# Altium schematic sheet Roll to Roll Transfer Printer System Schematic.SchDoc
size D; PageSetup: Record=PageOptions|CenterHorizontal=True|CenterVertical=True|PrintScale=0.32|XCorrection=1.00|YCorrection=1.00|PrintKind=1|BorderSize=5000000|LeftOffset=0|BottomOffset=0|Orientation=2|PaperLength=1000|PaperWidth=1000|Scale=100|PaperSource=7|PrintQuality=-4|MediaType=1|DitherType=10|PaperKind=Letter (8.5" x 11")|PrintScaleMode=1
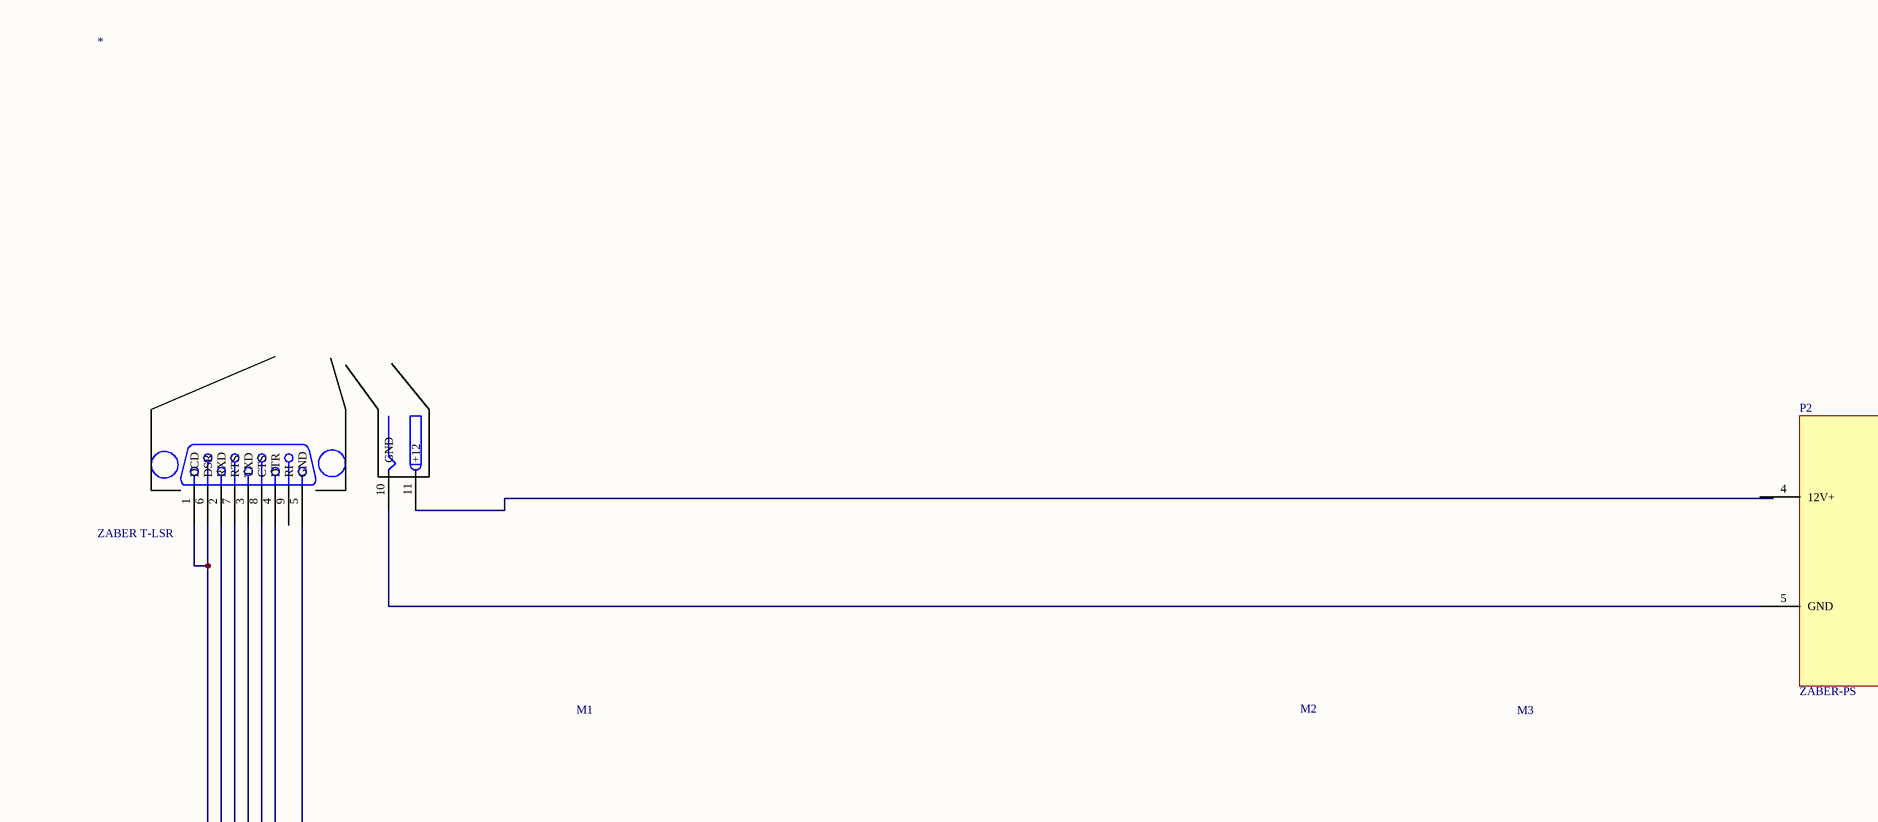
[diagram p0: Roll to Roll Transfer Printer System Schematic.SchDoc, top left]
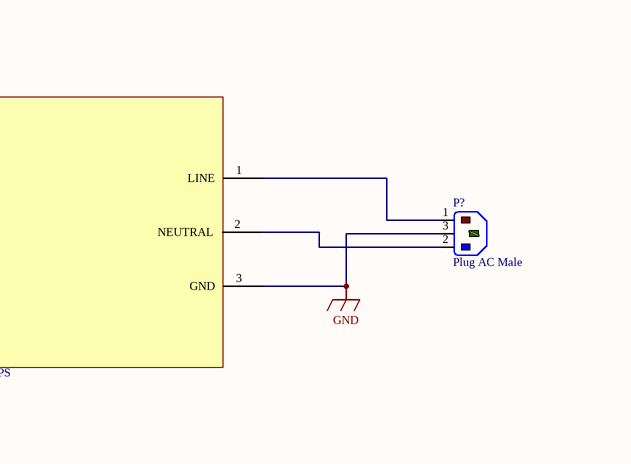
[diagram p1: Roll to Roll Transfer Printer System Schematic.SchDoc, top right]
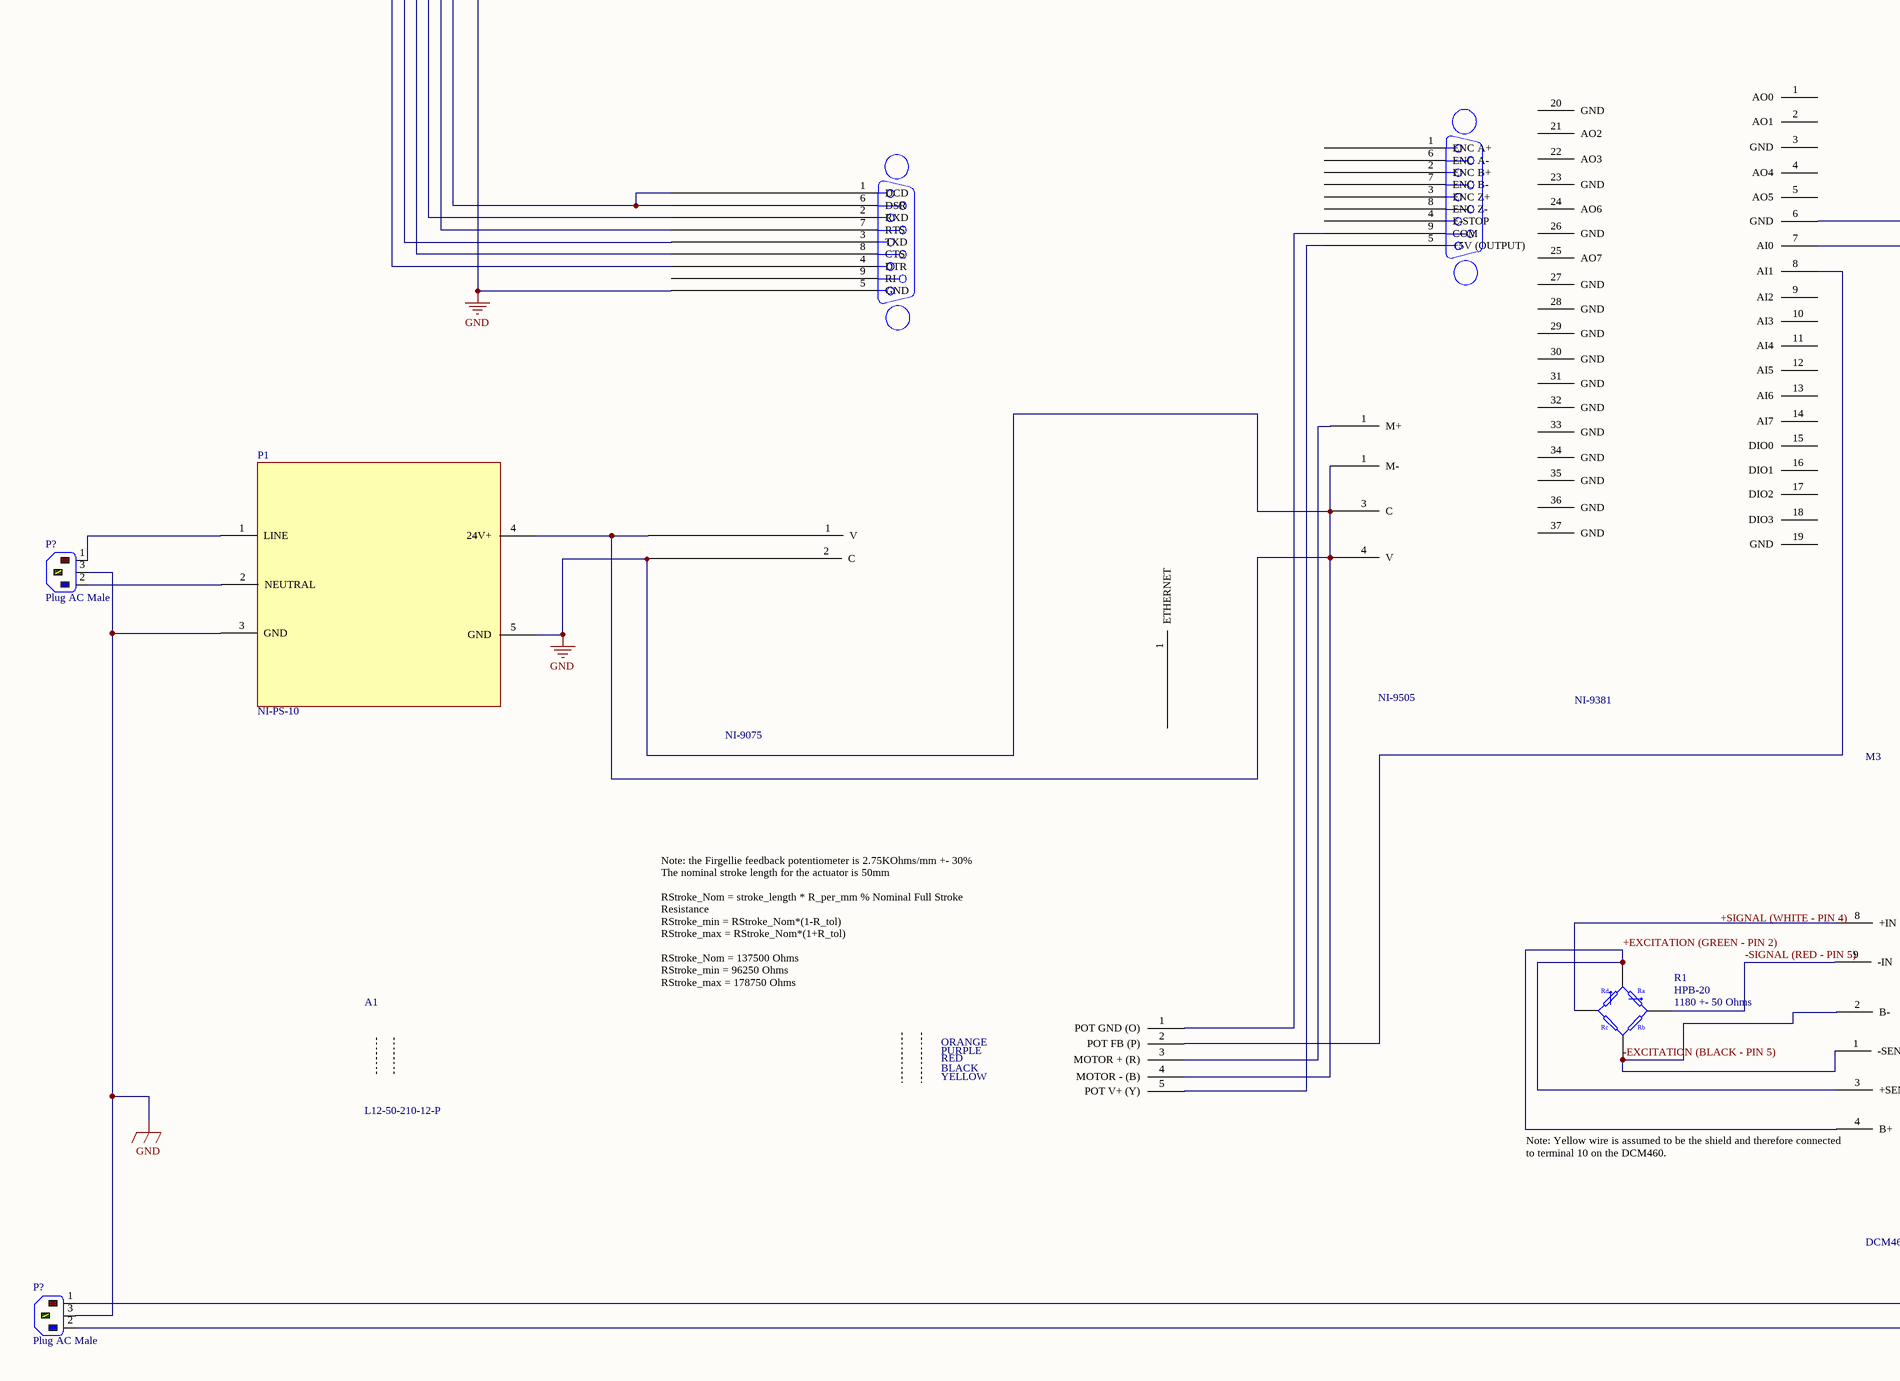
[diagram p2: Roll to Roll Transfer Printer System Schematic.SchDoc, bottom left]
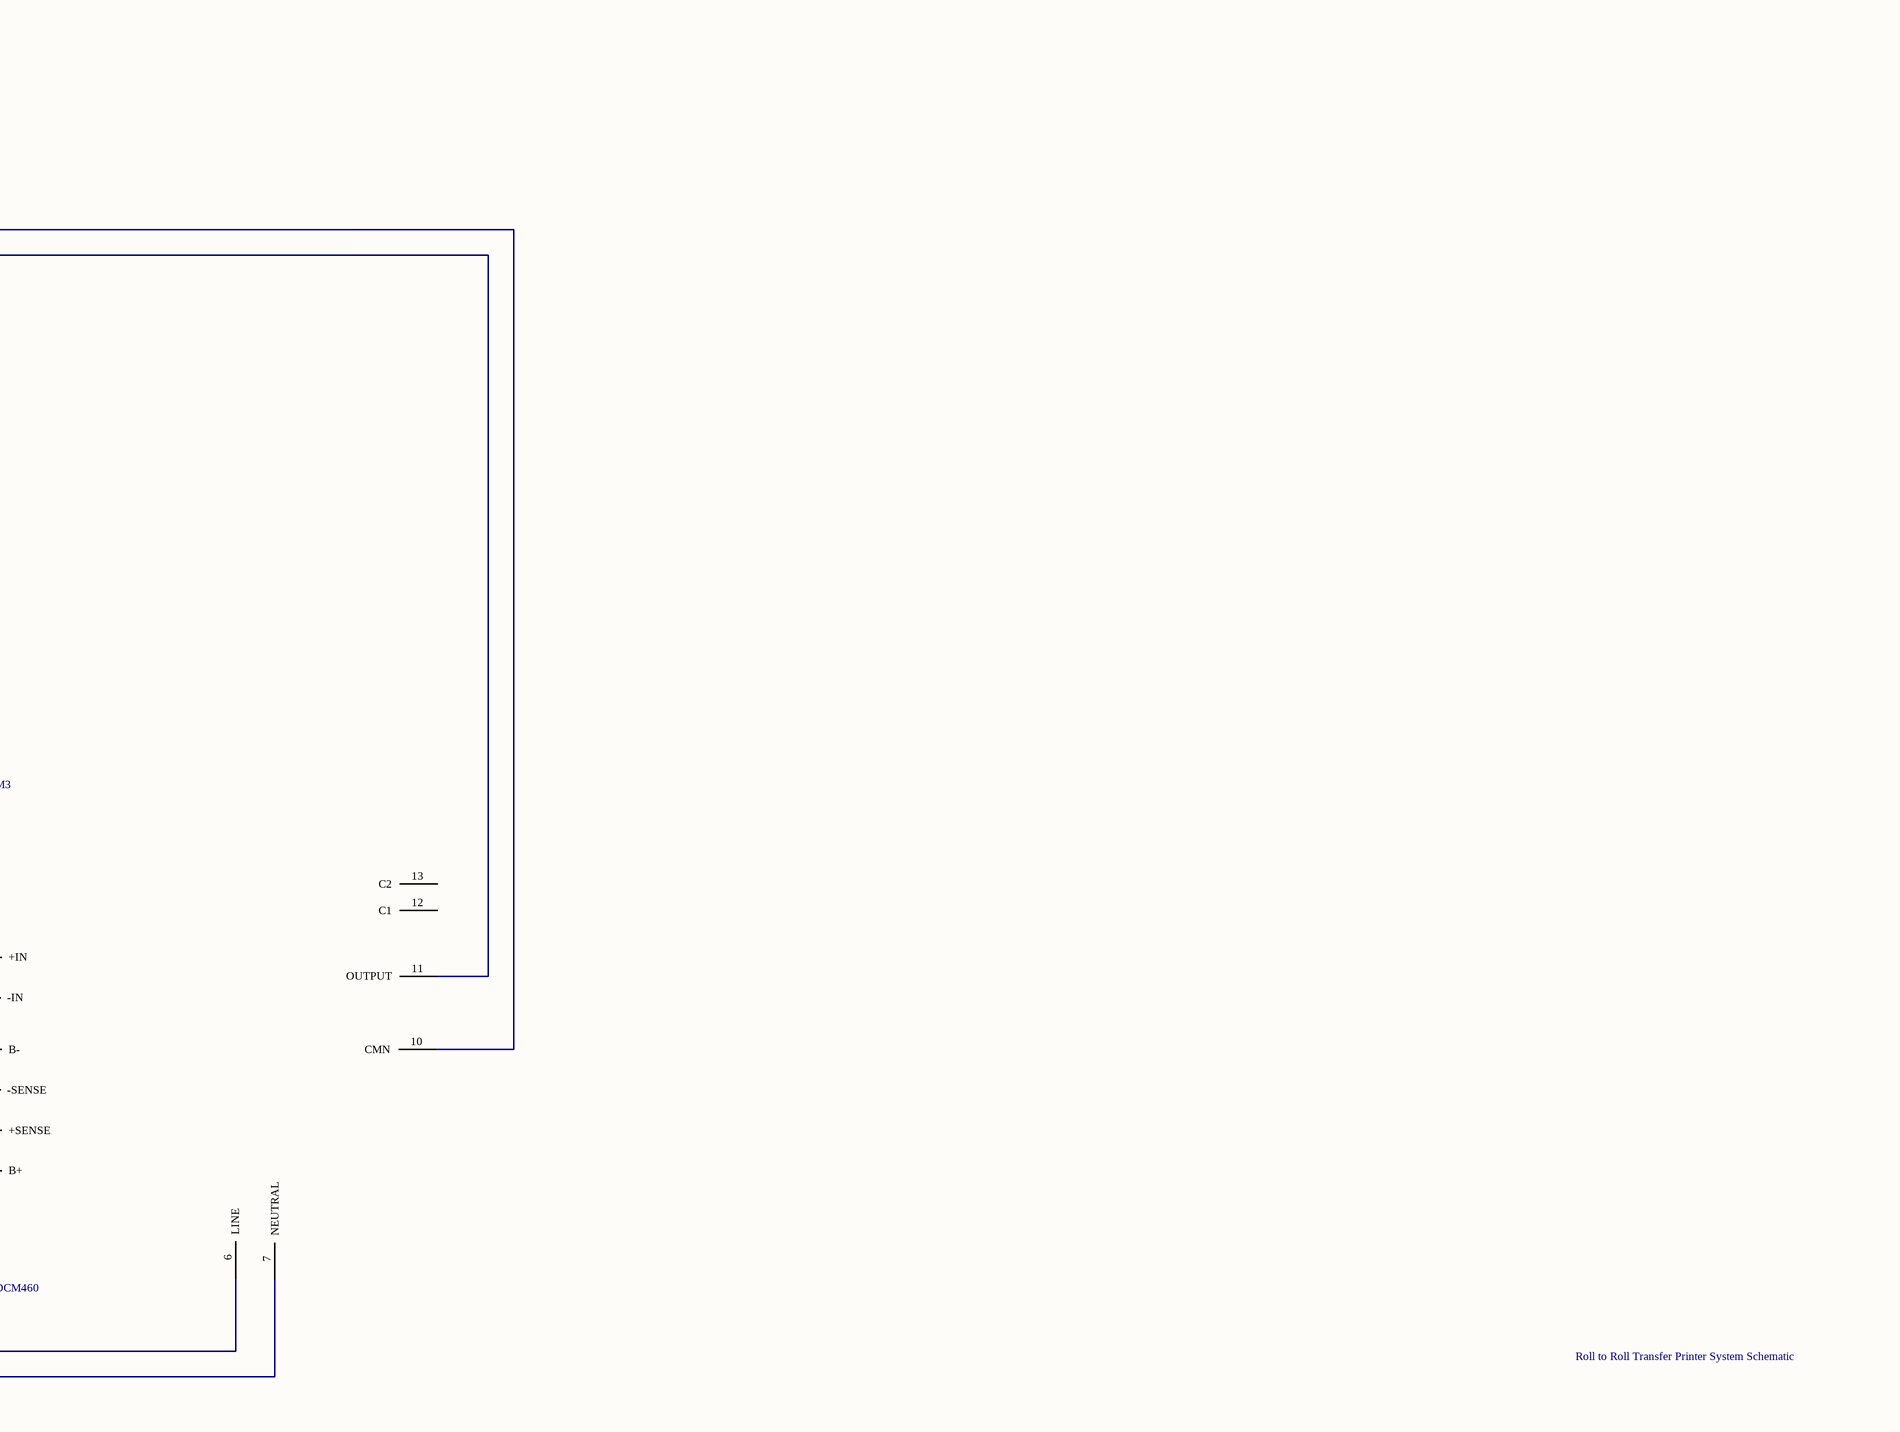
[diagram p3: Roll to Roll Transfer Printer System Schematic.SchDoc, bottom right]

## Parts
(Parts that share a designator on the sheet are numbered #1, #2 ... from top to bottom, then left to right.)
*  ZABER T-LSR
A1  L12-50-210-12-P
M1  NI-9075
M2  NI-9505
M3#1  NI-9381
M3#2  DCM460
P1  NI-PS-10
P2  ZABER-PS
P?#1  Plug AC Male  [IEC9.14-2H3]
P?#2  Plug AC Male  [IEC9.14-2H3]
P?#3  Plug AC Male  [IEC9.14-2H3]
R1  HPB-20  value 1180 +- 50 Ohms  [P04A]

## Nets
GND: *.5(GND) A1.4(MOTOR_-_(B)) M1.1(V) M1.2(C) M1.5(GND) M2.1(M-) M2.3(ENC_Z+) M2.4(E-STOP) P1.3(GND) P1.4(24V+) P1.5(GND) P2.3(GND) P?#1.3(E) P?#2.3(E) P?#3.3(E)
+EXCITATION (GREEN - PIN 2): M3#2.3(+SENSE) M3#2.4(B+) R1.1
-EXCITATION (BLACK - PIN 5): M3#2.1(-SENSE) M3#2.2(B-) R1.3
-SIGNAL (RED - PIN 5): M3#2.9(-IN) R1.2
Net*_1: *.1(DCD) *.6(DSR) M1.4(DTR)
Net*_2: *.2(RXD) M1.3(TXD)
Net*_3: *.3(TXD) M1.2(RXD)
Net*_4: *.4(DTR) M1.1(DCD) M1.6(DSR)
Net*_7: *.7(RTS) M1.8(CTS)
Net*_8: *.8(CTS) M1.7(RTS)
Net*_10: *.10(GND) P2.5(GND)
NetA1_1: A1.1(POT_GND_(O)) M2.9(COM)
NetA1_2: A1.2(POT_FB_(P)) M3#1.8(AI1)
NetA1_3: A1.3(MOTOR_+_(R)) M2.1(ENC_A+)
NetA1_5: A1.5(POT_V+_(Y)) M2.5(+5V_(OUTPUT))
NetM3#1_6: M3#1.6(GND) M3#2.10(CMN)
NetM3#1_7: M3#1.7(AI0) M3#2.11(OUTPUT)
NetM3#2_6: M3#2.6(LINE) P?#3.1(L)
NetM3#2_7: M3#2.7(NEUTRAL) P?#3.2(N)
NetM3#2_8: M3#2.8(+IN) R1.4
NetP1_1: P1.1(LINE) P?#2.1(L)
NetP1_2: P1.2(NEUTRAL) P?#2.2(N)
NetP2_1: P2.1(LINE) P?#1.1(L)
NetP2_2: P2.2(NEUTRAL) P?#1.2(N)

Not connected (* = marked no-connect by the designer): * 9(RI) 11(+12); M1 9(RI); M2 2(ENC_B+) 6(ENC_A-) 7(ENC_B-) 8(ENC_Z-); M3#1 1(AO0) 2(AO1) 3(GND) 4(AO4) 5(AO5) 9(AI2) 10(AI3) 11(AI4) 12(AI5) 13(AI6) 14(AI7) 15(DIO0) 16(DIO1) 17(DIO2) 18(DIO3) 19(GND) 20(GND) 21(AO2) 22(AO3) 23(GND) 24(AO6) 25(AO7) 26(GND) 27(GND) 28(GND) 29(GND) 30(GND) 31(GND) 32(GND) 33(GND) 34(GND) 35(GND) 36(GND) 37(GND); M3#2 12(C1) 13(C2); P2 4(12V+)

## Notes on the sheet
- Note: the Firgellie feedback potentiometer is 2.75KOhms/mm +- 30%
  The nominal stroke length for the actuator is 50mm
  RStroke_Nom = stroke_length * R_per_mm % Nominal Full Stroke Resistance
  RStroke_min = RStroke_Nom*(1-R_tol)
  RStroke_max = RStroke_Nom*(1+R_tol)
  RStroke_Nom = 137500 Ohms
  RStroke_min = 96250 Ohms
  RStroke_max = 178750 Ohms
- (near M3#2) Note: Yellow wire is assumed to be the shield and therefore connected to terminal 10 on the DCM460.
- Roll to Roll Transfer Printer System Schematic
- Labels drawn without touching a wire or pin: +SIGNAL (WHITE - PIN 4)
- (in symbol L12-50-210-12-P) ORANGE; PURPLE; RED; BLACK; YELLOW
- (in symbol Res Bridge) Rd; Ra; Rc; Rb

## Library data of the parts
P?#1-P?#3 = Plug AC Male: IEC Mains Power Inlet, EN60 320-1 C14 Class I Cold Condition, PC Flange Rear Mount, Chassis Plug; PackageDocument: ver.80, 15-Sep-2003; MaximumRating: 10A, 250V a.c. (UL & CSA 15A, 250V a.c.); MountingFixtures: Not drawn on schematic symbol.; PCB_Layout: Complies with manufacturer's recommendation.; DrillSize: Corresponds to nominal value.; Note: IEC Color Scheme employed for L, N and E.; Published: 15-Jul-2004; LatestRevisionDate: 15-Jul-2004; LatestRevisionNote: Component Replaced.; DatasheetDocument: ver.80, 15-Sep-2003; PackageReference: PX0580/PC; Publisher: Altium Limited; Terminations: P.C. Spills; ComponentLink1Description: Manufacturer Link; ComponentLink1URL: http://www.bulgin.co.uk/
R1 = Res Bridge: Resistor Bridge; Published: 24-Mar-1999; LatestRevisionDate: 17-Jul-2002; LatestRevisionNote: Re-released for DXP Platform.; PackageReference: P04A; Publisher: Altium Limited